# Altium schematic sheet Power.SchDoc: [Untitled]
size A3; Author: Nędzny Janusz; CompanyName: SensDx S.A.; Organization: SensDx S.A.; Address1: Wrocław Laboratories; SheetNumber: 1; SheetTotal: 1
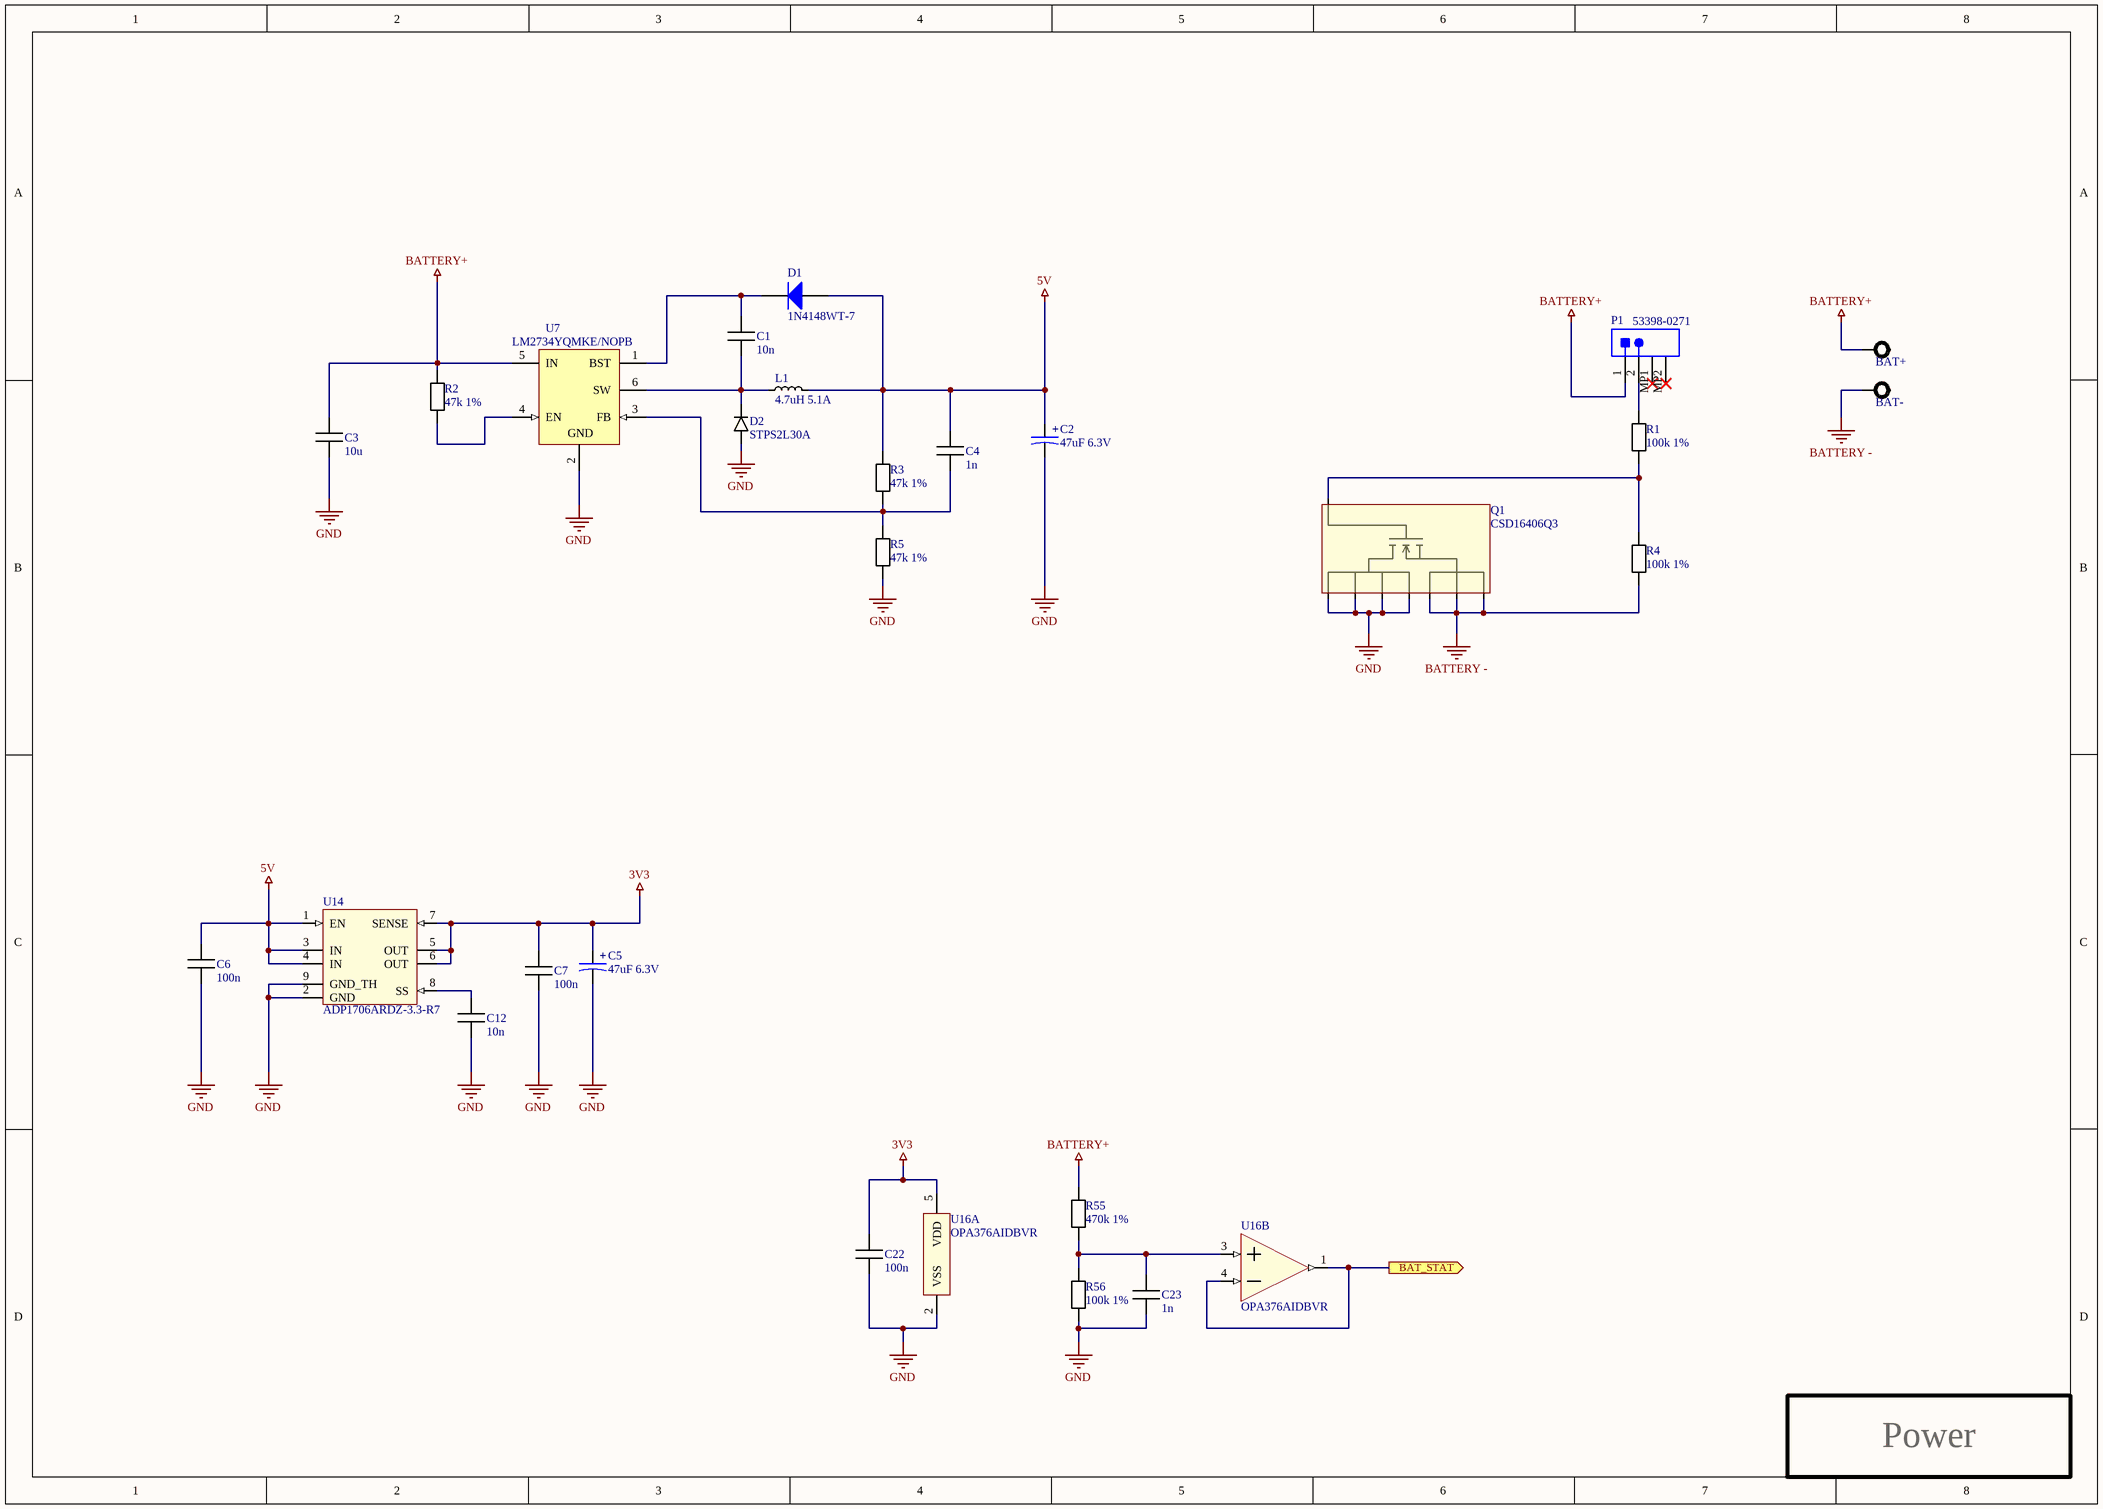
[diagram p0: Power.SchDoc]

## Parts
BAT+  1x2mm  [PAD 1x2mm]  (value not drawn)
BAT-  1x2mm  [PAD 1x2mm]  (value not drawn)
C1  10n  [C_0603_AUTO]
C2  47uF 6.3V  [Kemet_1206]
C3  10u  [C_0805_HAND]
C4  1n  [C_0603_AUTO]
C5  47uF 6.3V  [Kemet_1206]
C6  100n  [C_0603_AUTO]
C7  100n  [C_0603_AUTO]
C12  10n  [C_0603_AUTO]
C22  100n  [C_0603_AUTO]
C23  1n  [C_0603_AUTO]
D1  1N4148WT-7  [DIOD-SOD523-2_V]
D2  STPS2L30A  [SMA]
L1  4.7uH 5.1A  [XAL4030]
P1  53398-0271  [MOLX-53398-0271_V]
Q1  CSD16406Q3  [SON8]
R1  100k 1%  [R_0603_AUTO]
R2  47k 1%  [R_0603_AUTO]
R3  47k 1%  [R_0603_AUTO]
R4  100k 1%  [R_0603_AUTO]
R5  47k 1%  [R_0603_AUTO]
R55  470k 1%  [R_0603_AUTO]
R56  100k 1%  [R_0603_AUTO]
U7  LM2734YQMKE/NOPB  [DDC0006A_L]
U14  ADP1706ARDZ-3.3-R7  [SOIC-8_HAND_THERM]
U16  OPA376AIDBVR  [SOT23-5_AUTO]  (parts A,B of 2)

## Ports
BAT_STAT (out)

## Nets
3V3: C5.1 C7.2 C22.2 U14.5(OUT) U14.6(OUT) U14.7(SENSE) U16.5(VDD)
5V: C2.1 C4.2 C6.2 D1.2(A) L1.2 R3.2 U14.1(EN) U14.3(IN) U14.4(IN)
BATTERY -: BAT-.1 Q1.1(S) Q1.2(S) Q1.3(S) R4.1
BATTERY+: BAT+.1 C3.2 P1.1 R2.2 R55.2 U7.5(IN)
GND: C2.2 C3.1 C5.2 C6.1 C7.1 C12.1 C22.1 C23.1 D2.1(A) Q1.5(S) Q1.6(S) Q1.7(S) Q1.8(S) R5.1 R56.1 U7.2(GND) U14.2(GND) U14.9(GND_TH) U16.2(VSS)
BAT_STAT: U16.1(OUT) U16.4(IN-) ; port BAT_STAT
NetC1_1: C1.1 D2.2(C) L1.1 U7.6(SW)
NetC1_2: C1.2 D1.1(K) U7.1(BST)
NetC4_1: C4.1 R3.1 R5.2 U7.3(FB)
NetC12_2: C12.2 U14.8(SS)
NetC23_2: C23.2 R55.1 R56.2 U16.3(IN+)
NetP1_2: P1.2 R1.2
NetQ1_4: Q1.4(S) R1.1 R4.2
NetR2_1: R2.1 U7.4(EN)

Not connected (* = marked no-connect by the designer): P1 MP1* MP2*

## Notes on the sheet
- Power
- Title:
- Project name:
- Last modification:
- Author:
- Version control rev.:
- Sheet:
- /
- Sheet size:
- Variant:
- File name:
- A3
- Altium build:
- (in symbol T491A476M006AT) +

## Library data of the parts
BAT+ BAT- = PAD_small: copper pad; Manufacturer: NA; Value: NA; MPN: NA
C1 C3 C4 C6 C7 C12 C22 C23 = Capacitor: Manufacturer: [Generic]; MPN: [Generic]
  C1 C12: Value: 10n
  C3: Value: 10u
  C4 C23: Value: 1n
  C6 C7 C22: Value: 100n
C2 C5 = T491A476M006AT: Tantalum Surface Mount Capacitor, 47 uF, +/- 20%, 6.3 V, -55 to 125 degC, 2-Pin SMD, RoHS, Tape and Reel; Manufacturer: Kemet; Value: 47uF 6.3V; MPN: T491A476M006AT; ComponentLink1Description: Datasheet; ComponentLink1URL: http://www.farnell.com/datasheets/2319567.pdf?_ga=2.178180387.727493313.1541494519-1704470397.1535652464&_gac=1.36309652.1541494519.EAIaIQobChMI6_a5xrK_3gIVxbUYCh3rMw6BEAAYAiAAEgJZGfD_BwE; Supplier 1: Digi-Key; Supplier 2: Mouser; Supplier 3: Farnell; Supplier Part Number 3: 1457429; Supplier Part Number 2: 80-T491A476M06; Supplier Part Number 1: 399-3700-2-ND
D1 = CMP-2000-05518-1: Surface Mount Fast Switching Diode, -65 to 150 degC, 2-Pin SOD523, RoHS, Tape and Reel; Manufacturer: Diodes Inc; Forward Current: 250mA; Diode Configuration: Single; Number of Elements per Chip: 1; Datasheet URL: http://www.diodes.com/_files/datasheets/ds30396.pdf; Pin Count: 2; PartNumber: 1N4148WT; Mounting Type: SurfaceMount; Package Description: 2-Pin Small Outline Diode, Body 1.2 x 0.8 mm; Package URL: http://www.diodes.com/_files/packages/SOD523.pdf; Package Type: SOD-523; Manufacturer URL: http://www.diodes.com/; Datasheet Version: Rev. 16-2, 11/2015; Package Reference: SOD523-2; Mounting Technology: SurfaceMount
D2 = STPS2L30A: Schottky Diodes & Rectifiers 2.0 Amp 30 Volt; Manufacturer: STMicroelectronics; Value: NA; MPN: STPS2L30A; ComponentLink1Description: Datasheet; ComponentLink1URL: https://www.st.com/resource/en/datasheet/stps2l30.pdf; Supplier 1: Digi-Key; Supplier 2: Farnell; Supplier 3: Mouser; Supplier Part Number 2: 1467552; Supplier Part Number 1: 497-3759-2-ND; Supplier Part Number 3: 511-STPS2L30A
L1 = XAL4030-472: Fixed Inductor 4.7uH 20% 5.1A 44.1mOhms; Manufacturer: Coilcraft; Value: 4.7uH 5.1A; MPN: XAL4030-472
P1 = CMP-2000-07600-1: Male Header, Pitch 1.25 mm, 1 x 2 Position, Height 4.7 mm, -40 to 85 degC, RoHS, Tape and Reel; Manufacturer: Molex; Voltage Rating: 125V; Glow Wire Compliant: Non-compliant; Pitch: 1.25mm; Number of Positions: 2; Contact Resistance: 20mOhm; Insulation Resistance: 100MOhm; Current Rating: 1A; Mounting Technology: SurfaceMount; Colour: Natural; Mount: SurfaceMount; Termination: Solder; Packaging: TapeandReel; REACH SVHC: Unknown; Voltage Rating (AC): 125V; Housing Colour: Natural; Manufacturer URL: http://www.molex.com/; Max Operating Temperature: 85degC; Gender: Male; Lead Free: LeadFree; RoHSCompliant: True; Contact Plating: Tin; Package Reference: 53398-0271; Contact Material: Tin; Orientation: Vertical; Datasheet URL: http://www.molex.com/pdm_docs/sd/533980271_sd.pdf; Working Voltage: 125V; Flammability Rating: UL94V-0; Number of Contacts: 2; Package Description: Male Header, Pitch 1.25 mm, 1 x 2 Position, Height 4.7 mm; Datasheet Version: Rev. J, 09/2015; Number of Circuits: 2; Number of Rows: 1; Radiation Hardening: No; Voltage Rating (DC): 125V; Min Operating Temperature: -40degC; Housing Material: Nylon; Package Quantity: 1000
Q1 = CSD16406Q3: N-Channel NexFET™ Power MOSFET; Manufacturer: Texas Instruments; Value: NA; MPN: CSD16406Q3; ComponentLink1Description: Datasheet; ComponentLink1URL: http://www.ti.com/lit/ds/symlink/csd16406q3.pdf; Supplier 1: Digi-Key; Supplier 2: Mouser; Supplier 3: Farnell; Supplier Part Number 1: 296-24251-2-ND; Supplier Part Number 2: 595-CSD16406Q3; Supplier Part Number 3: 2458618
R1-R5 R55 R56 = Resistor: MPN: [Generic]; Manufacturer: [Generic]
  R1 R4 R56: Value: 100k 1%
  R2 R3 R5: Value: 47k 1%
  R55: Value: 470k 1%
U7 = CMP-0063-01059-3: 1A Load Step-Down DC-DC Regulator, 6-pin Tiny SOT23, Pb-Free; Manufacturer: Texas Instruments; PackageTopMarking: SVCB*XTT; PowerWise: N; CompType: MiscPower; Code_IPC: SOT26A-6; RoHS: Y; PackageDescription: Molded TSOT, 2.97 x 1.65 x 0.87mm Body, 6 Lead, 0.95mm Pitch; ComponentLink1URL: http://www.ti.com/general/docs/lit/getliterature.tsp?genericPartNumber=LM2734-Q1&fileType=pdf; PackageReference: DDC0006A; ComponentLink1Description: Datasheet URL; Code_JEDEC: MO-193-AA; PinCount: 6
U14 = ADP1706ARDZ-3.3-R7: LDO 3V3 1A Slow-Start, 450uV RMS noise; Manufacturer: Analog Devices; Value: NA; MPN: ADP1706ARDZ-3.3-R7; Supplier 1: Farnell; Supplier 2: Digi-Key; Supplier 3: Mouser; ComponentLink1Description: Datasheet; ComponentLink1URL: https://www.analog.com/media/en/technical-documentation/data-sheets/ADP1706_1707_1708.pdf; Supplier Part Number 1: 2727463; Supplier Part Number 2: ADP1706ARDZ-3.3-R7TR-ND; Supplier Part Number 3: 584-ADP1706ARDZ3.3R7
U16 = OPA376AIDBVR: OP Amp Single R-R 5-Pin SOT-23 T/R Ultra Low Offset; Manufacturer: Texas Instruments; Value: NA; MPN: OPA376AIDBVR; ComponentLink1Description: Datasheet; ComponentLink1URL: http://www.ti.com/lit/ds/symlink/opa376.pdf